# Altium schematic sheet Power.SchDoc
size A4; SheetNumber: 4; SheetTotal: 5
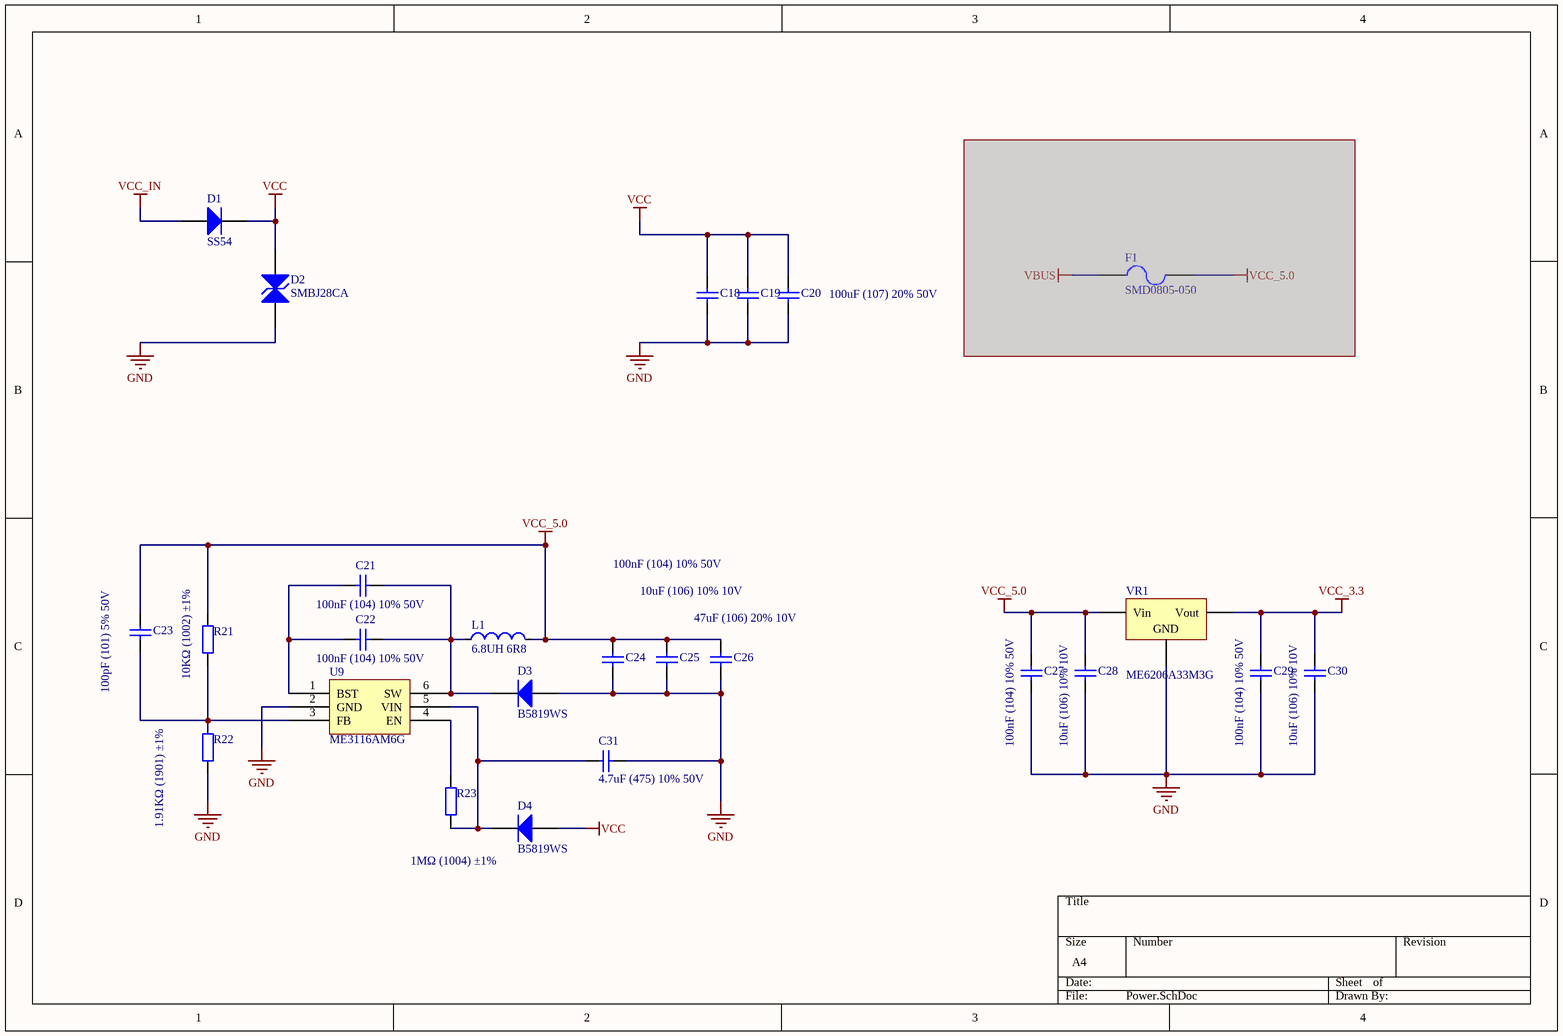
[diagram p0: Power.SchDoc]

## Parts
C18  100uF (107) 20% 50V  [C 1210_L]
C19  100uF (107) 20% 50V  [C 1210_L]  (value not drawn)
C20  100uF (107) 20% 50V  [C 1210_L]  (value not drawn)
C21  100nF (104) 10% 50V  [0603_C]
C22  100nF (104) 10% 50V  [0603_C]
C23  100pF (101) 5% 50V  [0603_C]
C24  100nF (104) 10% 50V  [0603_C]
C25  10uF (106) 10% 10V  [0603_C]
C26  47uF (106) 20% 10V  [1206_C]
C27  100nF (104) 10% 50V  [0603_C]
C28  10uF (106) 10% 10V  [0603_C]
C29  100nF (104) 10% 50V  [0603_C]
C30  10uF (106) 10% 10V  [0603_C]
C31  4.7uF (475) 10% 50V  [1206_C]
D1  SS54  [SMB]
D2  SMBJ28CA  [SMB]
D3  B5819WS  [SOD-323]
D4  B5819WS  [SOD-323]
F1  SMD0805-050  [FU 0805]  (masked out: inside a compile mask, not in the netlist)
L1  6.8UH 6R8  [L 1206]
R21  10KΩ (1002) ±1%  [0603_R]
R22  1.91KΩ (1901) ±1%  [0603_R]
R23  1MΩ (1004) ±1%  [0603_R]
U9  ME3116AM6G  [SOT-23-6]
VR1  ME6206A33M3G  [SOT-23-3L]

## Nets
GND: C18.1 C19.1 C20.1 C24.1 C25.1 C26.1 C27.1 C28.1 C29.1 C30.1 C31.2 D2.1(A) D3.1(A) R22.1 U9.2(GND) VR1.1(GND)
VCC: C18.2 C19.2 C20.2 D1.2(K) D2.2(K) D4.1(A)
VCC_3.3: C29.2 C30.2 VR1.2(Vout)
VCC_5.0: C23.2 C24.2 C25.2 C26.2 C27.2 C28.2 L1.2 R21.2 VR1.3(Vin)
VCC_IN: D1.1(A)
NetC21_1: C21.1 C22.1 U9.1(BST)
NetC21_2: C21.2 C22.2 D3.2(K) L1.1 U9.6(SW)
NetC23_1: C23.1 R21.1 R22.2 U9.3(FB)
NetC31_1: C31.1 D4.2(K) R23.1 U9.5(VIN)
NetR23_2: R23.2 U9.4(EN)

## Library data of the parts
C18-C20 = Cap: 贴片电容; Published: 8-Jun-2000; LatestRevisionDate: 17-Jul-2002; LatestRevisionNote: Re-released for DXP Platform.; PackageReference: RAD-0.3; Publisher: Altium Limited; PackageDescription: Radial Cap, Thru-Hole; 2 Leads; 0.3 in Pin Spacing
C21 C22 C24 C27 C29 = 0603 100nF (104) 10% 50V: 贴片电容; ComponentLink1Description: 供应商链接; ComponentLink1URL: http://www.szlcsc.com/product/details_15331.html; Package: 0603; Supplier: LC; SuppliersPartNumber: C14663
C23 = 0603 100pF (101) 5% 50V: 贴片电容; ComponentLink1Description: 供应商链接; ComponentLink1URL: http://www.szlcsc.com/product/details_15530.html; Package: 0603; Supplier: LC; SuppliersPartNumber: C14858
C25 C28 C30 = 0603 10uF (106) 10% 10V: 贴片电容; ComponentLink1Description: 供应商链接; ComponentLink1URL: http://www.szlcsc.com/product/details_20411.html; Package: 0603; Supplier: LC; SuppliersPartNumber: C19702
C26 = 1206 10uF (106) 10% 50V: 贴片电容; ComponentLink1Description: 供应商链接; ComponentLink1URL: http://www.szlcsc.com/product/details_14236.html; Package: 1206; Supplier: LC; SuppliersPartNumber: C13585
C31 = 1206 4.7uF (475) 10% 50V: 贴片电容; ComponentLink1Description: 供应商链接; ComponentLink1URL: http://www.szlcsc.com/product/details_30577.html; Package: 1206; Supplier: LC; SuppliersPartNumber: C29823
D1 = SMA(DO-214AC) SS54: 二极管; ComponentLink1Description: 供应商链接; ComponentLink1URL: http://www.szlcsc.com/product/details_23178.html; Package: SMA(DO-214AC); Supplier: LC; SuppliersPartNumber: C22452
D2 = SMB/DO-214AA P6SMB6.8CA: TVS; ComponentLink1Description: 供应商链接; ComponentLink1URL: http://www.szlcsc.com/product/details_79530.html; Package: SMB/DO-214AA; Supplier: LC; SuppliersPartNumber: C78395
D3 D4 = SOD-323 1N4148WS T4: 二极管; ComponentLink1Description: 供应商链接; ComponentLink1URL: http://www.szlcsc.com/product/details_2485.html; Package: SOD-323; Supplier: LC; SuppliersPartNumber: C2128
F1 = Fuse 2_1: 自恢复保险丝 500mA; Published: 8-Jun-2000; LatestRevisionDate: 17-Jul-2002; LatestRevisionNote: Re-released for DXP Platform.; PackageReference: PIN-W2/E2.8; Publisher: Altium Limited; PackageDescription: Thru-Hole; 2 Leads
L1 = IND: 贴片电感
R21 = 0603 10KΩ (1002) 1%: 贴片电阻; ComponentLink1Description: 供应商链接; ComponentLink1URL: http://www.szlcsc.com/product/details_26547.html; Package: 0603; Supplier: LC; SuppliersPartNumber: C25804
R22 = 0603 1KΩ (1001) 1%_1: 贴片电阻; ComponentLink1Description: 供应商链接; ComponentLink1URL: http://www.szlcsc.com/product/details_21904.html; Package: 0603; Supplier: LC; SuppliersPartNumber: C21190
R23 = 0603 1MΩ (1004) 1%: 贴片电阻; ComponentLink1Description: 供应商链接; ComponentLink1URL: http://www.szlcsc.com/product/details_23662.html; Package: 0603; Supplier: LC; SuppliersPartNumber: C22935
U9 = MP2451DT-LF-Z_[C14123]: DC-DC芯片; ComponentLink1Description: 供应商链接; ComponentLink1URL: http://www.szlcsc.com/product/details_14780.html; Package: SOT-23-6; Supplier: LC; SuppliersPartNumber: C14123
VR1 = SOT-23 XC6206P332MR: 低压差线性稳压(LDO); ComponentLink1Description: 供应商链接; ComponentLink1URL: http://www.szlcsc.com/product/details_5896.html; Package: SOT-23; Supplier: LC; SuppliersPartNumber: C5446